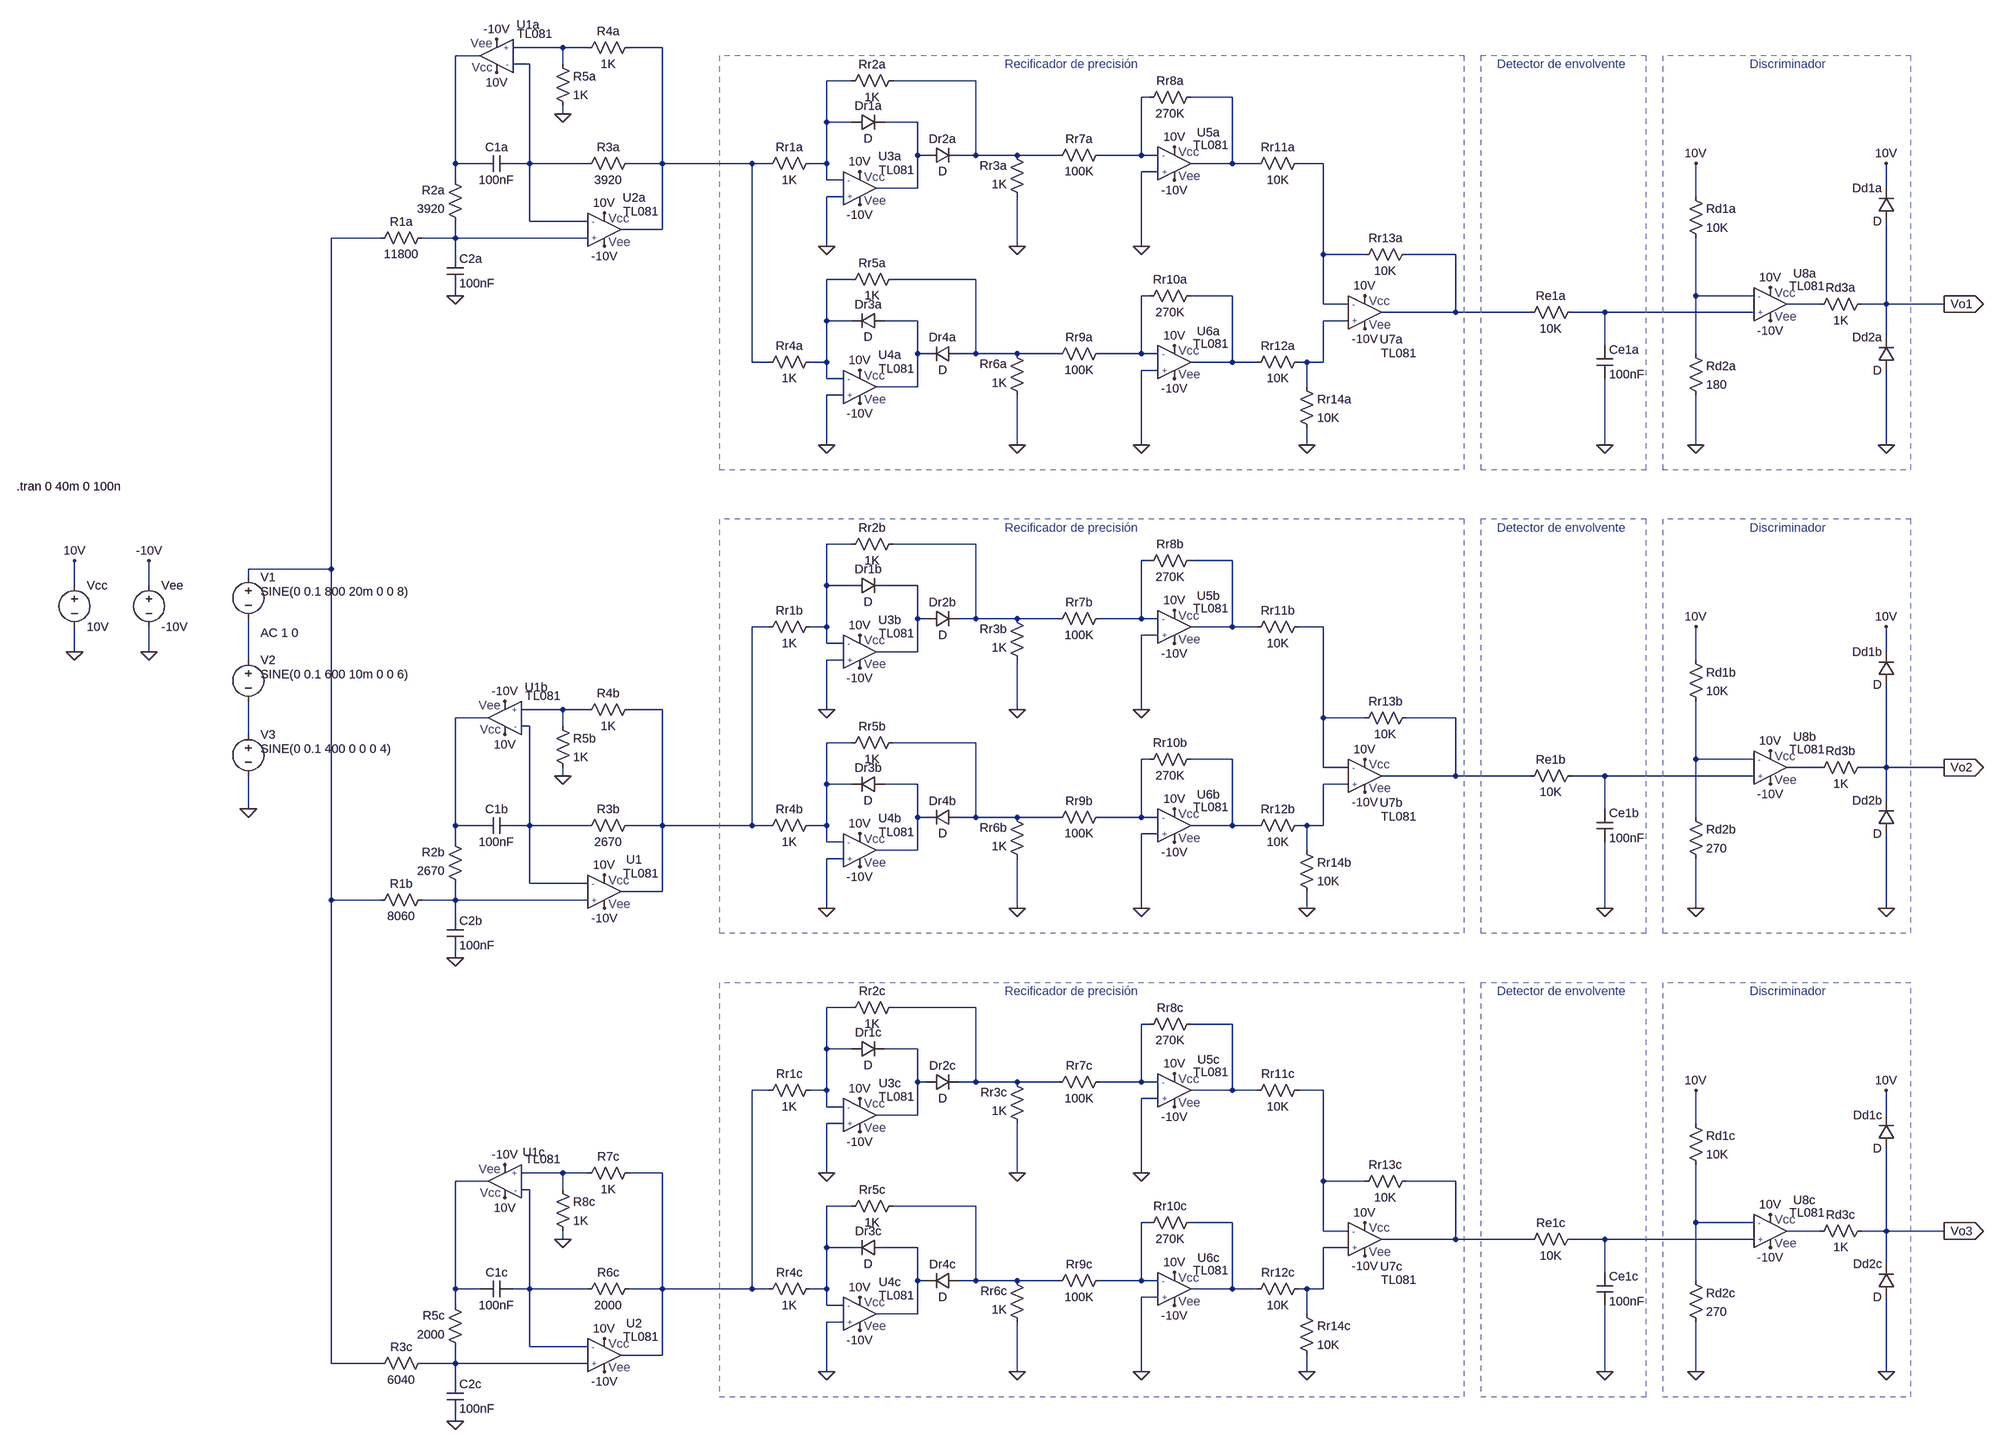
[diagram p0: schematic tl1.asc]
tl1.asc, the LTspice schematic file:
Version 4
SHEET 1 1076 680
WIRE -6400 -2448 -6496 -2448
WIRE -6352 -2448 -6400 -2448
WIRE -6208 -2448 -6272 -2448
WIRE -6560 -2432 -6608 -2432
WIRE -6464 -2416 -6496 -2416
WIRE -6400 -2416 -6400 -2448
WIRE -5792 -2384 -5840 -2384
WIRE -5552 -2384 -5712 -2384
WIRE -5216 -2352 -5232 -2352
WIRE -5056 -2352 -5136 -2352
WIRE -6400 -2320 -6400 -2336
WIRE -5840 -2304 -5840 -2384
WIRE -5792 -2304 -5840 -2304
WIRE -5664 -2304 -5728 -2304
WIRE -5664 -2240 -5664 -2304
WIRE -5648 -2240 -5664 -2240
WIRE -5552 -2240 -5552 -2384
WIRE -5552 -2240 -5584 -2240
WIRE -5472 -2240 -5552 -2240
WIRE -5392 -2240 -5472 -2240
WIRE -5232 -2240 -5232 -2352
WIRE -5232 -2240 -5312 -2240
WIRE -5200 -2240 -5232 -2240
WIRE -6608 -2224 -6608 -2432
WIRE -6560 -2224 -6608 -2224
WIRE -6464 -2224 -6464 -2416
WIRE -6464 -2224 -6496 -2224
WIRE -6352 -2224 -6464 -2224
WIRE -6208 -2224 -6208 -2448
WIRE -6208 -2224 -6272 -2224
WIRE -5984 -2224 -6208 -2224
WIRE -5952 -2224 -5984 -2224
WIRE -5840 -2224 -5840 -2304
WIRE -5840 -2224 -5872 -2224
WIRE -5056 -2224 -5056 -2352
WIRE -5056 -2224 -5136 -2224
WIRE -5008 -2224 -5056 -2224
WIRE -4880 -2224 -4928 -2224
WIRE -5200 -2208 -5232 -2208
WIRE -6608 -2192 -6608 -2224
WIRE -5840 -2192 -5840 -2224
WIRE -5808 -2192 -5840 -2192
WIRE -5664 -2176 -5664 -2240
WIRE -5664 -2176 -5744 -2176
WIRE -3792 -2176 -3792 -2224
WIRE -5808 -2160 -5840 -2160
WIRE -4160 -2160 -4160 -2224
WIRE -6464 -2112 -6464 -2224
WIRE -6352 -2112 -6464 -2112
WIRE -6208 -2096 -6208 -2224
WIRE -6208 -2096 -6288 -2096
WIRE -6752 -2080 -6848 -2080
WIRE -6608 -2080 -6608 -2112
WIRE -6608 -2080 -6672 -2080
WIRE -6352 -2080 -6608 -2080
WIRE -5840 -2064 -5840 -2160
WIRE -5472 -2064 -5472 -2160
WIRE -5232 -2064 -5232 -2208
WIRE -6608 -2048 -6608 -2080
WIRE -4880 -2048 -4880 -2224
WIRE -4800 -2048 -4880 -2048
WIRE -4624 -2048 -4720 -2048
WIRE -5792 -2000 -5840 -2000
WIRE -5552 -2000 -5712 -2000
WIRE -6608 -1968 -6608 -1984
WIRE -5216 -1968 -5232 -1968
WIRE -5056 -1968 -5136 -1968
WIRE -4160 -1968 -4160 -2080
WIRE -4048 -1968 -4160 -1968
WIRE -4880 -1952 -4880 -2048
WIRE -4832 -1952 -4880 -1952
WIRE -3920 -1952 -3984 -1952
WIRE -3792 -1952 -3792 -2112
WIRE -3792 -1952 -3840 -1952
WIRE -3680 -1952 -3792 -1952
WIRE -4624 -1936 -4624 -2048
WIRE -4624 -1936 -4768 -1936
WIRE -4480 -1936 -4624 -1936
WIRE -4336 -1936 -4400 -1936
WIRE -4048 -1936 -4336 -1936
WIRE -5840 -1920 -5840 -2000
WIRE -5792 -1920 -5840 -1920
WIRE -5664 -1920 -5728 -1920
WIRE -4832 -1920 -4880 -1920
WIRE -3792 -1888 -3792 -1952
WIRE -4336 -1872 -4336 -1936
WIRE -5664 -1856 -5664 -1920
WIRE -5648 -1856 -5664 -1856
WIRE -5552 -1856 -5552 -2000
WIRE -5552 -1856 -5584 -1856
WIRE -5472 -1856 -5552 -1856
WIRE -5392 -1856 -5472 -1856
WIRE -5232 -1856 -5232 -1968
WIRE -5232 -1856 -5312 -1856
WIRE -5200 -1856 -5232 -1856
WIRE -4160 -1856 -4160 -1968
WIRE -5984 -1840 -5984 -2224
WIRE -5952 -1840 -5984 -1840
WIRE -5840 -1840 -5840 -1920
WIRE -5840 -1840 -5872 -1840
WIRE -5056 -1840 -5056 -1968
WIRE -5056 -1840 -5136 -1840
WIRE -5008 -1840 -5056 -1840
WIRE -4912 -1840 -4928 -1840
WIRE -4880 -1840 -4880 -1920
WIRE -4880 -1840 -4912 -1840
WIRE -5200 -1824 -5232 -1824
WIRE -5840 -1808 -5840 -1840
WIRE -5808 -1808 -5840 -1808
WIRE -5664 -1792 -5664 -1856
WIRE -5664 -1792 -5744 -1792
WIRE -4912 -1792 -4912 -1840
WIRE -5808 -1776 -5840 -1776
WIRE -5840 -1680 -5840 -1776
WIRE -5472 -1680 -5472 -1776
WIRE -5232 -1680 -5232 -1824
WIRE -4912 -1680 -4912 -1712
WIRE -4336 -1680 -4336 -1808
WIRE -4160 -1680 -4160 -1776
WIRE -3792 -1680 -3792 -1824
WIRE -5792 -1488 -5840 -1488
WIRE -5552 -1488 -5712 -1488
WIRE -5216 -1456 -5232 -1456
WIRE -5056 -1456 -5136 -1456
WIRE -6848 -1440 -6848 -2080
WIRE -6848 -1440 -7008 -1440
WIRE -7008 -1424 -7008 -1440
WIRE -7344 -1408 -7344 -1456
WIRE -7200 -1408 -7200 -1456
WIRE -5840 -1408 -5840 -1488
WIRE -5792 -1408 -5840 -1408
WIRE -5664 -1408 -5728 -1408
WIRE -5664 -1344 -5664 -1408
WIRE -5648 -1344 -5664 -1344
WIRE -5552 -1344 -5552 -1488
WIRE -5552 -1344 -5584 -1344
WIRE -5472 -1344 -5552 -1344
WIRE -5392 -1344 -5472 -1344
WIRE -5232 -1344 -5232 -1456
WIRE -5232 -1344 -5312 -1344
WIRE -5200 -1344 -5232 -1344
WIRE -5952 -1328 -5984 -1328
WIRE -5840 -1328 -5840 -1408
WIRE -5840 -1328 -5872 -1328
WIRE -5056 -1328 -5056 -1456
WIRE -5056 -1328 -5136 -1328
WIRE -5008 -1328 -5056 -1328
WIRE -4880 -1328 -4928 -1328
WIRE -5200 -1312 -5232 -1312
WIRE -5840 -1296 -5840 -1328
WIRE -5808 -1296 -5840 -1296
WIRE -7344 -1280 -7344 -1328
WIRE -7200 -1280 -7200 -1328
WIRE -5664 -1280 -5664 -1344
WIRE -5664 -1280 -5744 -1280
WIRE -3792 -1280 -3792 -1328
WIRE -7008 -1264 -7008 -1344
WIRE -5808 -1264 -5840 -1264
WIRE -4160 -1264 -4160 -1328
WIRE -6400 -1168 -6480 -1168
WIRE -6352 -1168 -6400 -1168
WIRE -6208 -1168 -6272 -1168
WIRE -5840 -1168 -5840 -1264
WIRE -5472 -1168 -5472 -1264
WIRE -5232 -1168 -5232 -1312
WIRE -6544 -1152 -6608 -1152
WIRE -4880 -1152 -4880 -1328
WIRE -4800 -1152 -4880 -1152
WIRE -4624 -1152 -4720 -1152
WIRE -6464 -1136 -6480 -1136
WIRE -6400 -1136 -6400 -1168
WIRE -7008 -1120 -7008 -1184
WIRE -5792 -1104 -5840 -1104
WIRE -5552 -1104 -5712 -1104
WIRE -5216 -1072 -5232 -1072
WIRE -5056 -1072 -5136 -1072
WIRE -4160 -1072 -4160 -1184
WIRE -4048 -1072 -4160 -1072
WIRE -4880 -1056 -4880 -1152
WIRE -4832 -1056 -4880 -1056
WIRE -3920 -1056 -3984 -1056
WIRE -3792 -1056 -3792 -1216
WIRE -3792 -1056 -3840 -1056
WIRE -3680 -1056 -3792 -1056
WIRE -6400 -1040 -6400 -1056
WIRE -4624 -1040 -4624 -1152
WIRE -4624 -1040 -4768 -1040
WIRE -4480 -1040 -4624 -1040
WIRE -4336 -1040 -4400 -1040
WIRE -4048 -1040 -4336 -1040
WIRE -5840 -1024 -5840 -1104
WIRE -5792 -1024 -5840 -1024
WIRE -5664 -1024 -5728 -1024
WIRE -4832 -1024 -4880 -1024
WIRE -3792 -992 -3792 -1056
WIRE -7008 -976 -7008 -1040
WIRE -4336 -976 -4336 -1040
WIRE -5664 -960 -5664 -1024
WIRE -5648 -960 -5664 -960
WIRE -5552 -960 -5552 -1104
WIRE -5552 -960 -5584 -960
WIRE -5472 -960 -5552 -960
WIRE -5392 -960 -5472 -960
WIRE -5232 -960 -5232 -1072
WIRE -5232 -960 -5312 -960
WIRE -5200 -960 -5232 -960
WIRE -4160 -960 -4160 -1072
WIRE -6608 -944 -6608 -1152
WIRE -6560 -944 -6608 -944
WIRE -6464 -944 -6464 -1136
WIRE -6464 -944 -6496 -944
WIRE -6352 -944 -6464 -944
WIRE -6208 -944 -6208 -1168
WIRE -6208 -944 -6272 -944
WIRE -5984 -944 -5984 -1328
WIRE -5984 -944 -6208 -944
WIRE -5952 -944 -5984 -944
WIRE -5840 -944 -5840 -1024
WIRE -5840 -944 -5872 -944
WIRE -5056 -944 -5056 -1072
WIRE -5056 -944 -5136 -944
WIRE -5008 -944 -5056 -944
WIRE -4912 -944 -4928 -944
WIRE -4880 -944 -4880 -1024
WIRE -4880 -944 -4912 -944
WIRE -5200 -928 -5232 -928
WIRE -6608 -912 -6608 -944
WIRE -5840 -912 -5840 -944
WIRE -5808 -912 -5840 -912
WIRE -5664 -896 -5664 -960
WIRE -5664 -896 -5744 -896
WIRE -4912 -896 -4912 -944
WIRE -5808 -880 -5840 -880
WIRE -6464 -832 -6464 -944
WIRE -6352 -832 -6464 -832
WIRE -6208 -816 -6208 -944
WIRE -6208 -816 -6288 -816
WIRE -6848 -800 -6848 -1440
WIRE -6752 -800 -6848 -800
WIRE -6608 -800 -6608 -832
WIRE -6608 -800 -6672 -800
WIRE -6352 -800 -6608 -800
WIRE -5840 -784 -5840 -880
WIRE -5472 -784 -5472 -880
WIRE -5232 -784 -5232 -928
WIRE -4912 -784 -4912 -816
WIRE -4336 -784 -4336 -912
WIRE -4160 -784 -4160 -880
WIRE -3792 -784 -3792 -928
WIRE -6608 -768 -6608 -800
WIRE -6608 -688 -6608 -704
WIRE -5792 -592 -5840 -592
WIRE -5552 -592 -5712 -592
WIRE -5216 -560 -5232 -560
WIRE -5056 -560 -5136 -560
WIRE -5840 -512 -5840 -592
WIRE -5792 -512 -5840 -512
WIRE -5664 -512 -5728 -512
WIRE -5664 -448 -5664 -512
WIRE -5648 -448 -5664 -448
WIRE -5552 -448 -5552 -592
WIRE -5552 -448 -5584 -448
WIRE -5472 -448 -5552 -448
WIRE -5392 -448 -5472 -448
WIRE -5232 -448 -5232 -560
WIRE -5232 -448 -5312 -448
WIRE -5200 -448 -5232 -448
WIRE -5952 -432 -5984 -432
WIRE -5840 -432 -5840 -512
WIRE -5840 -432 -5872 -432
WIRE -5056 -432 -5056 -560
WIRE -5056 -432 -5136 -432
WIRE -5008 -432 -5056 -432
WIRE -4880 -432 -4928 -432
WIRE -5200 -416 -5232 -416
WIRE -5840 -400 -5840 -432
WIRE -5808 -400 -5840 -400
WIRE -5664 -384 -5664 -448
WIRE -5664 -384 -5744 -384
WIRE -3792 -384 -3792 -432
WIRE -5808 -368 -5840 -368
WIRE -4160 -368 -4160 -432
WIRE -6400 -272 -6480 -272
WIRE -6352 -272 -6400 -272
WIRE -6208 -272 -6272 -272
WIRE -5840 -272 -5840 -368
WIRE -5472 -272 -5472 -368
WIRE -5232 -272 -5232 -416
WIRE -6544 -256 -6608 -256
WIRE -4880 -256 -4880 -432
WIRE -4800 -256 -4880 -256
WIRE -4624 -256 -4720 -256
WIRE -6464 -240 -6480 -240
WIRE -6400 -240 -6400 -272
WIRE -5792 -208 -5840 -208
WIRE -5552 -208 -5712 -208
WIRE -5216 -176 -5232 -176
WIRE -5056 -176 -5136 -176
WIRE -4160 -176 -4160 -288
WIRE -4048 -176 -4160 -176
WIRE -4880 -160 -4880 -256
WIRE -4832 -160 -4880 -160
WIRE -3920 -160 -3984 -160
WIRE -3792 -160 -3792 -320
WIRE -3792 -160 -3840 -160
WIRE -3680 -160 -3792 -160
WIRE -6400 -144 -6400 -160
WIRE -4624 -144 -4624 -256
WIRE -4624 -144 -4768 -144
WIRE -4480 -144 -4624 -144
WIRE -4336 -144 -4400 -144
WIRE -4048 -144 -4336 -144
WIRE -5840 -128 -5840 -208
WIRE -5792 -128 -5840 -128
WIRE -5664 -128 -5728 -128
WIRE -4832 -128 -4880 -128
WIRE -3792 -96 -3792 -160
WIRE -4336 -80 -4336 -144
WIRE -5664 -64 -5664 -128
WIRE -5648 -64 -5664 -64
WIRE -5552 -64 -5552 -208
WIRE -5552 -64 -5584 -64
WIRE -5472 -64 -5552 -64
WIRE -5392 -64 -5472 -64
WIRE -5232 -64 -5232 -176
WIRE -5232 -64 -5312 -64
WIRE -5200 -64 -5232 -64
WIRE -4160 -64 -4160 -176
WIRE -6608 -48 -6608 -256
WIRE -6560 -48 -6608 -48
WIRE -6464 -48 -6464 -240
WIRE -6464 -48 -6496 -48
WIRE -6352 -48 -6464 -48
WIRE -6208 -48 -6208 -272
WIRE -6208 -48 -6272 -48
WIRE -5984 -48 -5984 -432
WIRE -5984 -48 -6208 -48
WIRE -5952 -48 -5984 -48
WIRE -5840 -48 -5840 -128
WIRE -5840 -48 -5872 -48
WIRE -5056 -48 -5056 -176
WIRE -5056 -48 -5136 -48
WIRE -5008 -48 -5056 -48
WIRE -4912 -48 -4928 -48
WIRE -4880 -48 -4880 -128
WIRE -4880 -48 -4912 -48
WIRE -5200 -32 -5232 -32
WIRE -6608 -16 -6608 -48
WIRE -5840 -16 -5840 -48
WIRE -5808 -16 -5840 -16
WIRE -5664 0 -5664 -64
WIRE -5664 0 -5744 0
WIRE -4912 0 -4912 -48
WIRE -5808 16 -5840 16
WIRE -6464 64 -6464 -48
WIRE -6352 64 -6464 64
WIRE -6208 80 -6208 -48
WIRE -6208 80 -6288 80
WIRE -6848 96 -6848 -800
WIRE -6752 96 -6848 96
WIRE -6608 96 -6608 64
WIRE -6608 96 -6672 96
WIRE -6352 96 -6608 96
WIRE -5840 112 -5840 16
WIRE -5472 112 -5472 16
WIRE -5232 112 -5232 -32
WIRE -4912 112 -4912 80
WIRE -4336 112 -4336 -16
WIRE -4160 112 -4160 16
WIRE -3792 112 -3792 -32
WIRE -6608 128 -6608 96
WIRE -6608 208 -6608 192
FLAG -6400 -2320 0
FLAG -6608 -1968 0
FLAG -6400 -1040 0
FLAG -6608 -688 0
FLAG -6400 -144 0
FLAG -6608 208 0
FLAG -7008 -976 0
FLAG -5840 -2064 0
FLAG -5472 -2064 0
FLAG -7344 -1456 10V
FLAG -7344 -1280 0
FLAG -5840 -1680 0
FLAG -5472 -1680 0
FLAG -5232 -2064 0
FLAG -4912 -1680 0
FLAG -4336 -1680 0
FLAG -4160 -1680 0
FLAG -4160 -2224 10V
FLAG -3792 -1680 0
FLAG -3792 -2224 10V
FLAG -3680 -1952 Vo1
IOPIN -3680 -1952 Out
FLAG -6512 -1120 10V
FLAG -6512 -1184 -10V
FLAG -7200 -1456 -10V
FLAG -7200 -1280 0
FLAG -6320 -2128 10V
FLAG -6320 -2064 -10V
FLAG -6512 -224 10V
FLAG -6512 -288 -10V
FLAG -6528 -2400 10V
FLAG -6528 -2464 -10V
FLAG -6320 -848 10V
FLAG -6320 -784 -10V
FLAG -6320 48 10V
FLAG -6320 112 -10V
FLAG -5168 -2256 10V
FLAG -5168 -2192 -10V
FLAG -4800 -1968 10V
FLAG -4800 -1904 -10V
FLAG -5232 -1680 0
FLAG -5168 -1872 10V
FLAG -5168 -1808 -10V
FLAG -5776 -2208 10V
FLAG -5776 -2144 -10V
FLAG -5776 -1824 10V
FLAG -5776 -1760 -10V
FLAG -4016 -1984 10V
FLAG -4016 -1920 -10V
FLAG -5840 -1168 0
FLAG -5472 -1168 0
FLAG -5840 -784 0
FLAG -5472 -784 0
FLAG -5232 -1168 0
FLAG -4912 -784 0
FLAG -4336 -784 0
FLAG -4160 -784 0
FLAG -4160 -1328 10V
FLAG -3792 -784 0
FLAG -3792 -1328 10V
FLAG -3680 -1056 Vo2
IOPIN -3680 -1056 Out
FLAG -5168 -1360 10V
FLAG -5168 -1296 -10V
FLAG -4800 -1072 10V
FLAG -4800 -1008 -10V
FLAG -5232 -784 0
FLAG -5168 -976 10V
FLAG -5168 -912 -10V
FLAG -5776 -1312 10V
FLAG -5776 -1248 -10V
FLAG -5776 -928 10V
FLAG -5776 -864 -10V
FLAG -4016 -1088 10V
FLAG -4016 -1024 -10V
FLAG -5840 -272 0
FLAG -5472 -272 0
FLAG -5840 112 0
FLAG -5472 112 0
FLAG -5232 -272 0
FLAG -4912 112 0
FLAG -4336 112 0
FLAG -4160 112 0
FLAG -4160 -432 10V
FLAG -3792 112 0
FLAG -3792 -432 10V
FLAG -3680 -160 Vo3
IOPIN -3680 -160 Out
FLAG -5168 -464 10V
FLAG -5168 -400 -10V
FLAG -4800 -176 10V
FLAG -4800 -112 -10V
FLAG -5232 112 0
FLAG -5168 -80 10V
FLAG -5168 -16 -10V
FLAG -5776 -416 10V
FLAG -5776 -352 -10V
FLAG -5776 -32 10V
FLAG -5776 32 -10V
FLAG -4016 -192 10V
FLAG -4016 -128 -10V
SYMBOL res -6656 -2096 R90
WINDOW 0 0 56 VBottom 2
WINDOW 3 32 56 VTop 2
SYMATTR InstName R1a
SYMATTR Value 11800
SYMBOL res -6592 -2096 R180
WINDOW 0 36 76 Left 2
WINDOW 3 36 40 Left 2
SYMATTR InstName R2a
SYMATTR Value 3920
SYMBOL res -6368 -2208 R270
WINDOW 0 32 56 VTop 2
WINDOW 3 0 56 VBottom 2
SYMATTR InstName R3a
SYMATTR Value 3920
SYMBOL res -6368 -2432 R270
WINDOW 0 32 56 VTop 2
WINDOW 3 0 56 VBottom 2
SYMATTR InstName R4a
SYMATTR Value 1K
SYMBOL res -6416 -2432 R0
SYMATTR InstName R5a
SYMATTR Value 1K
SYMBOL cap -6496 -2240 R90
WINDOW 0 0 32 VBottom 2
WINDOW 3 32 32 VTop 2
SYMATTR InstName C1a
SYMATTR Value 100nF
SYMBOL cap -6624 -2048 R0
SYMATTR InstName C2a
SYMATTR Value 100nF
SYMBOL voltage -7008 -1440 R0
WINDOW 3 24 44 Left 2
WINDOW 123 24 124 Left 2
WINDOW 39 0 0 Left 2
SYMATTR Value SINE(0 0.1 800 20m 0 0 8)
SYMATTR Value2 AC 1 0
SYMATTR InstName V1
SYMBOL res -6656 -816 R90
WINDOW 0 0 56 VBottom 2
WINDOW 3 32 56 VTop 2
SYMATTR InstName R1b
SYMATTR Value 8060
SYMBOL res -6592 -816 R180
WINDOW 0 36 76 Left 2
WINDOW 3 36 40 Left 2
SYMATTR InstName R2b
SYMATTR Value 2670
SYMBOL res -6368 -928 R270
WINDOW 0 32 56 VTop 2
WINDOW 3 0 56 VBottom 2
SYMATTR InstName R3b
SYMATTR Value 2670
SYMBOL res -6368 -1152 R270
WINDOW 0 32 56 VTop 2
WINDOW 3 0 56 VBottom 2
SYMATTR InstName R4b
SYMATTR Value 1K
SYMBOL res -6416 -1152 R0
SYMATTR InstName R5b
SYMATTR Value 1K
SYMBOL cap -6496 -960 R90
WINDOW 0 0 32 VBottom 2
WINDOW 3 32 32 VTop 2
SYMATTR InstName C1b
SYMATTR Value 100nF
SYMBOL cap -6624 -768 R0
SYMATTR InstName C2b
SYMATTR Value 100nF
SYMBOL res -6656 80 R90
WINDOW 0 0 56 VBottom 2
WINDOW 3 32 56 VTop 2
SYMATTR InstName R3c
SYMATTR Value 6040
SYMBOL res -6592 80 R180
WINDOW 0 36 76 Left 2
WINDOW 3 36 40 Left 2
SYMATTR InstName R5c
SYMATTR Value 2000
SYMBOL res -6368 -32 R270
WINDOW 0 32 56 VTop 2
WINDOW 3 0 56 VBottom 2
SYMATTR InstName R6c
SYMATTR Value 2000
SYMBOL res -6368 -256 R270
WINDOW 0 32 56 VTop 2
WINDOW 3 0 56 VBottom 2
SYMATTR InstName R7c
SYMATTR Value 1K
SYMBOL res -6416 -256 R0
SYMATTR InstName R8c
SYMATTR Value 1K
SYMBOL cap -6496 -64 R90
WINDOW 0 0 32 VBottom 2
WINDOW 3 32 32 VTop 2
SYMATTR InstName C1c
SYMATTR Value 100nF
SYMBOL cap -6624 128 R0
SYMATTR InstName C2c
SYMATTR Value 100nF
SYMBOL voltage -7008 -1280 R0
WINDOW 3 24 44 Left 2
WINDOW 123 24 124 Left 2
WINDOW 39 0 0 Left 2
SYMATTR Value SINE(0 0.1 600 10m 0 0 6)
SYMATTR InstName V2
SYMBOL voltage -7008 -1136 R0
WINDOW 3 24 44 Left 2
WINDOW 123 24 124 Left 2
WINDOW 39 0 0 Left 2
SYMATTR Value SINE(0 0.1 400 0 0 0 4)
SYMATTR InstName V3
SYMBOL res -5856 -2240 R90
WINDOW 0 0 56 VBottom 2
WINDOW 3 32 56 VTop 2
SYMATTR InstName Rr1a
SYMATTR Value 1K
SYMBOL res -5696 -2400 R90
WINDOW 0 0 56 VBottom 2
WINDOW 3 32 56 VTop 2
SYMATTR InstName Rr2a
SYMATTR Value 1K
SYMBOL res -5456 -2144 R180
WINDOW 0 36 76 Left 2
WINDOW 3 36 40 Left 2
SYMATTR InstName Rr3a
SYMATTR Value 1K
SYMBOL diode -5792 -2288 R270
WINDOW 0 32 32 VTop 2
WINDOW 3 0 32 VBottom 2
SYMATTR InstName Dr1a
SYMBOL diode -5648 -2224 R270
WINDOW 0 32 32 VTop 2
WINDOW 3 0 32 VBottom 2
SYMATTR InstName Dr2a
SYMBOL res -5296 -2256 R90
WINDOW 0 0 56 VBottom 2
WINDOW 3 32 56 VTop 2
SYMATTR InstName Rr7a
SYMATTR Value 100K
SYMBOL voltage -7344 -1424 R0
WINDOW 123 0 0 Left 2
WINDOW 39 0 0 Left 2
SYMATTR InstName Vcc
SYMATTR Value 10V
SYMBOL res -5856 -1856 R90
WINDOW 0 0 56 VBottom 2
WINDOW 3 32 56 VTop 2
SYMATTR InstName Rr4a
SYMATTR Value 1K
SYMBOL res -5696 -2016 R90
WINDOW 0 0 56 VBottom 2
WINDOW 3 32 56 VTop 2
SYMATTR InstName Rr5a
SYMATTR Value 1K
SYMBOL res -5456 -1760 R180
WINDOW 0 36 76 Left 2
WINDOW 3 36 40 Left 2
SYMATTR InstName Rr6a
SYMATTR Value 1K
SYMBOL res -5296 -1872 R90
WINDOW 0 0 56 VBottom 2
WINDOW 3 32 56 VTop 2
SYMATTR InstName Rr9a
SYMATTR Value 100K
SYMBOL diode -5728 -1936 R90
WINDOW 0 0 32 VBottom 2
WINDOW 3 32 32 VTop 2
SYMATTR InstName Dr3a
SYMBOL diode -5584 -1872 R90
WINDOW 0 0 32 VBottom 2
WINDOW 3 32 32 VTop 2
SYMATTR InstName Dr4a
SYMBOL res -5120 -2368 R90
WINDOW 0 0 56 VBottom 2
WINDOW 3 32 56 VTop 2
SYMATTR InstName Rr8a
SYMATTR Value 270K
SYMBOL res -4912 -1856 R90
WINDOW 0 0 56 VBottom 2
WINDOW 3 32 56 VTop 2
SYMATTR InstName Rr12a
SYMATTR Value 10K
SYMBOL res -4704 -2064 R90
WINDOW 0 0 56 VBottom 2
WINDOW 3 32 56 VTop 2
SYMATTR InstName Rr13a
SYMATTR Value 10K
SYMBOL res -4912 -2240 R90
WINDOW 0 0 56 VBottom 2
WINDOW 3 32 56 VTop 2
SYMATTR InstName Rr11a
SYMATTR Value 10K
SYMBOL res -4928 -1808 R0
SYMATTR InstName Rr14a
SYMATTR Value 10K
SYMBOL res -4384 -1952 R90
WINDOW 0 0 56 VBottom 2
WINDOW 3 32 56 VTop 2
SYMATTR InstName Re1a
SYMATTR Value 10K
SYMBOL cap -4352 -1872 R0
SYMATTR InstName Ce1a
SYMATTR Value 100nF
SYMBOL res -4176 -2176 R0
SYMATTR InstName Rd1a
SYMATTR Value 10K
SYMBOL res -4176 -1872 R0
SYMATTR InstName Rd2a
SYMATTR Value 180
SYMBOL res -3824 -1968 R90
WINDOW 0 0 56 VBottom 2
WINDOW 3 32 56 VTop 2
SYMATTR InstName Rd3a
SYMATTR Value 1K
SYMBOL diode -3776 -2112 R180
WINDOW 0 24 64 Left 2
WINDOW 3 24 0 Left 2
SYMATTR InstName Dd1a
SYMBOL diode -3776 -1824 R180
WINDOW 0 24 64 Left 2
WINDOW 3 24 0 Left 2
SYMATTR InstName Dd2a
SYMBOL AutoGenerated\\TL081 -6512 -1152 R180
WINDOW 0 -61 75 Bottom 2
WINDOW 3 -74 27 Top 2
SYMATTR InstName U1b
SYMBOL voltage -7200 -1424 R0
WINDOW 123 0 0 Left 2
WINDOW 39 0 0 Left 2
SYMATTR InstName Vee
SYMATTR Value -10V
SYMBOL AutoGenerated\\TL081 -6320 -2096 R0
WINDOW 0 58 -46 Bottom 2
SYMATTR InstName U2a
SYMBOL AutoGenerated\\TL081 -6512 -256 R180
WINDOW 0 -56 72 Bottom 2
WINDOW 3 -74 27 Top 2
SYMATTR InstName U1c
SYMBOL AutoGenerated\\TL081 -6528 -2432 R180
WINDOW 0 -61 76 Bottom 2
WINDOW 3 -74 27 Top 2
SYMATTR InstName U1a
SYMBOL AutoGenerated\\TL081 -6320 -816 R0
WINDOW 0 58 -46 Bottom 2
SYMATTR InstName U1
SYMBOL AutoGenerated\\TL081 -6320 80 R0
WINDOW 0 58 -46 Bottom 2
SYMATTR InstName U2
SYMBOL AutoGenerated\\TL081 -5168 -2224 R0
SYMATTR InstName U5a
SYMBOL AutoGenerated\\TL081 -4800 -1936 R0
WINDOW 0 51 68 Bottom 2
WINDOW 3 66 63 Top 2
SYMATTR InstName U7a
SYMBOL res -5120 -1984 R90
WINDOW 0 0 56 VBottom 2
WINDOW 3 32 56 VTop 2
SYMATTR InstName Rr10a
SYMATTR Value 270K
SYMBOL AutoGenerated\\TL081 -5168 -1840 R0
SYMATTR InstName U6a
SYMBOL AutoGenerated\\TL081 -5776 -2176 R0
WINDOW 0 58 -46 Bottom 2
SYMATTR InstName U3a
SYMBOL AutoGenerated\\TL081 -5776 -1792 R0
WINDOW 0 58 -46 Bottom 2
SYMATTR InstName U4a
SYMBOL AutoGenerated\\TL081 -4016 -1952 R0
SYMATTR InstName U8a
SYMBOL res -5856 -1344 R90
WINDOW 0 0 56 VBottom 2
WINDOW 3 32 56 VTop 2
SYMATTR InstName Rr1b
SYMATTR Value 1K
SYMBOL res -5696 -1504 R90
WINDOW 0 0 56 VBottom 2
WINDOW 3 32 56 VTop 2
SYMATTR InstName Rr2b
SYMATTR Value 1K
SYMBOL res -5456 -1248 R180
WINDOW 0 36 76 Left 2
WINDOW 3 36 40 Left 2
SYMATTR InstName Rr3b
SYMATTR Value 1K
SYMBOL diode -5792 -1392 R270
WINDOW 0 32 32 VTop 2
WINDOW 3 0 32 VBottom 2
SYMATTR InstName Dr1b
SYMBOL diode -5648 -1328 R270
WINDOW 0 32 32 VTop 2
WINDOW 3 0 32 VBottom 2
SYMATTR InstName Dr2b
SYMBOL res -5296 -1360 R90
WINDOW 0 0 56 VBottom 2
WINDOW 3 32 56 VTop 2
SYMATTR InstName Rr7b
SYMATTR Value 100K
SYMBOL res -5856 -960 R90
WINDOW 0 0 56 VBottom 2
WINDOW 3 32 56 VTop 2
SYMATTR InstName Rr4b
SYMATTR Value 1K
SYMBOL res -5696 -1120 R90
WINDOW 0 0 56 VBottom 2
WINDOW 3 32 56 VTop 2
SYMATTR InstName Rr5b
SYMATTR Value 1K
SYMBOL res -5456 -864 R180
WINDOW 0 36 76 Left 2
WINDOW 3 36 40 Left 2
SYMATTR InstName Rr6b
SYMATTR Value 1K
SYMBOL res -5296 -976 R90
WINDOW 0 0 56 VBottom 2
WINDOW 3 32 56 VTop 2
SYMATTR InstName Rr9b
SYMATTR Value 100K
SYMBOL diode -5728 -1040 R90
WINDOW 0 0 32 VBottom 2
WINDOW 3 32 32 VTop 2
SYMATTR InstName Dr3b
SYMBOL diode -5584 -976 R90
WINDOW 0 0 32 VBottom 2
WINDOW 3 32 32 VTop 2
SYMATTR InstName Dr4b
SYMBOL res -5120 -1472 R90
WINDOW 0 0 56 VBottom 2
WINDOW 3 32 56 VTop 2
SYMATTR InstName Rr8b
SYMATTR Value 270K
SYMBOL res -4912 -960 R90
WINDOW 0 0 56 VBottom 2
WINDOW 3 32 56 VTop 2
SYMATTR InstName Rr12b
SYMATTR Value 10K
SYMBOL res -4704 -1168 R90
WINDOW 0 0 56 VBottom 2
WINDOW 3 32 56 VTop 2
SYMATTR InstName Rr13b
SYMATTR Value 10K
SYMBOL res -4912 -1344 R90
WINDOW 0 0 56 VBottom 2
WINDOW 3 32 56 VTop 2
SYMATTR InstName Rr11b
SYMATTR Value 10K
SYMBOL res -4928 -912 R0
SYMATTR InstName Rr14b
SYMATTR Value 10K
SYMBOL res -4384 -1056 R90
WINDOW 0 0 56 VBottom 2
WINDOW 3 32 56 VTop 2
SYMATTR InstName Re1b
SYMATTR Value 10K
SYMBOL cap -4352 -976 R0
SYMATTR InstName Ce1b
SYMATTR Value 100nF
SYMBOL res -4176 -1280 R0
SYMATTR InstName Rd1b
SYMATTR Value 10K
SYMBOL res -4176 -976 R0
SYMATTR InstName Rd2b
SYMATTR Value 270
SYMBOL res -3824 -1072 R90
WINDOW 0 0 56 VBottom 2
WINDOW 3 32 56 VTop 2
SYMATTR InstName Rd3b
SYMATTR Value 1K
SYMBOL diode -3776 -1216 R180
WINDOW 0 24 64 Left 2
WINDOW 3 24 0 Left 2
SYMATTR InstName Dd1b
SYMBOL diode -3776 -928 R180
WINDOW 0 24 64 Left 2
WINDOW 3 24 0 Left 2
SYMATTR InstName Dd2b
SYMBOL AutoGenerated\\TL081 -5168 -1328 R0
SYMATTR InstName U5b
SYMBOL AutoGenerated\\TL081 -4800 -1040 R0
WINDOW 0 51 68 Bottom 2
WINDOW 3 66 63 Top 2
SYMATTR InstName U7b
SYMBOL res -5120 -1088 R90
WINDOW 0 0 56 VBottom 2
WINDOW 3 32 56 VTop 2
SYMATTR InstName Rr10b
SYMATTR Value 270K
SYMBOL AutoGenerated\\TL081 -5168 -944 R0
SYMATTR InstName U6b
SYMBOL AutoGenerated\\TL081 -5776 -1280 R0
WINDOW 0 58 -46 Bottom 2
SYMATTR InstName U3b
SYMBOL AutoGenerated\\TL081 -5776 -896 R0
WINDOW 0 58 -46 Bottom 2
SYMATTR InstName U4b
SYMBOL AutoGenerated\\TL081 -4016 -1056 R0
SYMATTR InstName U8b
SYMBOL res -5856 -448 R90
WINDOW 0 0 56 VBottom 2
WINDOW 3 32 56 VTop 2
SYMATTR InstName Rr1c
SYMATTR Value 1K
SYMBOL res -5696 -608 R90
WINDOW 0 0 56 VBottom 2
WINDOW 3 32 56 VTop 2
SYMATTR InstName Rr2c
SYMATTR Value 1K
SYMBOL res -5456 -352 R180
WINDOW 0 36 76 Left 2
WINDOW 3 36 40 Left 2
SYMATTR InstName Rr3c
SYMATTR Value 1K
SYMBOL diode -5792 -496 R270
WINDOW 0 32 32 VTop 2
WINDOW 3 0 32 VBottom 2
SYMATTR InstName Dr1c
SYMBOL diode -5648 -432 R270
WINDOW 0 32 32 VTop 2
WINDOW 3 0 32 VBottom 2
SYMATTR InstName Dr2c
SYMBOL res -5296 -464 R90
WINDOW 0 0 56 VBottom 2
WINDOW 3 32 56 VTop 2
SYMATTR InstName Rr7c
SYMATTR Value 100K
SYMBOL res -5856 -64 R90
WINDOW 0 0 56 VBottom 2
WINDOW 3 32 56 VTop 2
SYMATTR InstName Rr4c
SYMATTR Value 1K
SYMBOL res -5696 -224 R90
WINDOW 0 0 56 VBottom 2
WINDOW 3 32 56 VTop 2
SYMATTR InstName Rr5c
SYMATTR Value 1K
SYMBOL res -5456 32 R180
WINDOW 0 36 76 Left 2
WINDOW 3 36 40 Left 2
SYMATTR InstName Rr6c
SYMATTR Value 1K
SYMBOL res -5296 -80 R90
WINDOW 0 0 56 VBottom 2
WINDOW 3 32 56 VTop 2
SYMATTR InstName Rr9c
SYMATTR Value 100K
SYMBOL diode -5728 -144 R90
WINDOW 0 0 32 VBottom 2
WINDOW 3 32 32 VTop 2
SYMATTR InstName Dr3c
SYMBOL diode -5584 -80 R90
WINDOW 0 0 32 VBottom 2
WINDOW 3 32 32 VTop 2
SYMATTR InstName Dr4c
SYMBOL res -5120 -576 R90
WINDOW 0 0 56 VBottom 2
WINDOW 3 32 56 VTop 2
SYMATTR InstName Rr8c
SYMATTR Value 270K
SYMBOL res -4912 -64 R90
WINDOW 0 0 56 VBottom 2
WINDOW 3 32 56 VTop 2
SYMATTR InstName Rr12c
SYMATTR Value 10K
SYMBOL res -4704 -272 R90
WINDOW 0 0 56 VBottom 2
WINDOW 3 32 56 VTop 2
SYMATTR InstName Rr13c
SYMATTR Value 10K
SYMBOL res -4912 -448 R90
WINDOW 0 0 56 VBottom 2
WINDOW 3 32 56 VTop 2
SYMATTR InstName Rr11c
SYMATTR Value 10K
SYMBOL res -4928 -16 R0
SYMATTR InstName Rr14c
SYMATTR Value 10K
SYMBOL res -4384 -160 R90
WINDOW 0 0 56 VBottom 2
WINDOW 3 32 56 VTop 2
SYMATTR InstName Re1c
SYMATTR Value 10K
SYMBOL cap -4352 -80 R0
SYMATTR InstName Ce1c
SYMATTR Value 100nF
SYMBOL res -4176 -384 R0
SYMATTR InstName Rd1c
SYMATTR Value 10K
SYMBOL res -4176 -80 R0
SYMATTR InstName Rd2c
SYMATTR Value 270
SYMBOL res -3824 -176 R90
WINDOW 0 0 56 VBottom 2
WINDOW 3 32 56 VTop 2
SYMATTR InstName Rd3c
SYMATTR Value 1K
SYMBOL diode -3776 -320 R180
WINDOW 0 24 64 Left 2
WINDOW 3 24 0 Left 2
SYMATTR InstName Dd1c
SYMBOL diode -3776 -32 R180
WINDOW 0 24 64 Left 2
WINDOW 3 24 0 Left 2
SYMATTR InstName Dd2c
SYMBOL AutoGenerated\\TL081 -5168 -432 R0
SYMATTR InstName U5c
SYMBOL AutoGenerated\\TL081 -4800 -144 R0
WINDOW 0 51 68 Bottom 2
WINDOW 3 66 63 Top 2
SYMATTR InstName U7c
SYMBOL res -5120 -192 R90
WINDOW 0 0 56 VBottom 2
WINDOW 3 32 56 VTop 2
SYMATTR InstName Rr10c
SYMATTR Value 270K
SYMBOL AutoGenerated\\TL081 -5168 -48 R0
SYMATTR InstName U6c
SYMBOL AutoGenerated\\TL081 -5776 -384 R0
WINDOW 0 58 -46 Bottom 2
SYMATTR InstName U3c
SYMBOL AutoGenerated\\TL081 -5776 0 R0
WINDOW 0 58 -46 Bottom 2
SYMATTR InstName U4c
SYMBOL AutoGenerated\\TL081 -4016 -160 R0
SYMATTR InstName U8c
TEXT -7456 -1600 Left 2 !.tran 0 40m 0 100n
TEXT -5496 -2416 Left 2 ;Recificador de precisión
TEXT -4544 -2416 Left 2 ;Detector de envolvente
TEXT -4056 -2416 Left 2 ;Discriminador
TEXT -5496 -1520 Left 2 ;Recificador de precisión
TEXT -4544 -1520 Left 2 ;Detector de envolvente
TEXT -4056 -1520 Left 2 ;Discriminador
TEXT -5496 -624 Left 2 ;Recificador de precisión
TEXT -4544 -624 Left 2 ;Detector de envolvente
TEXT -4056 -624 Left 2 ;Discriminador
RECTANGLE Normal -4608 -2432 -6048 -1632 2
RECTANGLE Normal -4256 -2432 -4576 -1632 2
RECTANGLE Normal -3744 -2432 -4224 -1632 2
RECTANGLE Normal -4608 -1536 -6048 -736 2
RECTANGLE Normal -4256 -1536 -4576 -736 2
RECTANGLE Normal -3744 -1536 -4224 -736 2
RECTANGLE Normal -4608 -640 -6048 160 2
RECTANGLE Normal -4256 -640 -4576 160 2
RECTANGLE Normal -3744 -640 -4224 160 2

The netlist it stands for:
* tl1.asc
R1a N012 N011 11800
R2a N012 N003 3920
R3a N004 N002 3920
R4a N001 N002 1K
R5a N001 0 1K
C1a N004 N003 100nF
C2a N012 0 100nF
V1 N011 N030 SINE(0 0.1 800 20m 0 0 8) AC 1 0
R1b N045 N011 8060
R2b N045 N032 2670
R3b N034 N028 2670
R4b N031 N028 1K
R5b N031 0 1K
C1b N034 N032 100nF
C2b N045 0 100nF
R3c N066 N011 6040
R5c N066 N054 2000
R6c N056 N051 2000
R7c N053 N051 1K
R8c N053 0 1K
C1c N056 N054 100nF
C2c N066 0 100nF
V2 N030 N035 SINE(0 0.1 600 10m 0 0 6)
V3 N035 0 SINE(0 0.1 400 0 0 0 4)
Rr1a N005 N002 1K
Rr2a N006 N005 1K
Rr3a 0 N006 1K
Dr1a N005 N009 D
Dr2a N009 N006 D
Rr7a N007 N006 100K
Vcc 10V 0 10V
Rr4a N014 N002 1K
Rr5a N015 N014 1K
Rr6a 0 N015 1K
Rr9a N016 N015 100K
Dr3a N021 N014 D
Dr4a N015 N021 D
Rr8a N008 N007 270K
Rr12a N022 N017 10K
Rr13a N013 N010 10K
Rr11a N010 N008 10K
Rr14a N022 0 10K
Re1a N020 N013 10K
Ce1a N020 0 100nF
Rd1a 10V N018 10K
Rd2a N018 0 180
Rd3a Vo1 N019 1K
Dd1a Vo1 10V D
Dd2a 0 Vo1 D
XU1b N031 N034 10V -10V N032 TL081  ; pins + - ? ? ?
Vee -10V 0 -10V
XU2a N012 N004 10V -10V N002 TL081  ; pins + - ? ? ?
XU1c N053 N056 10V -10V N054 TL081  ; pins + - ? ? ?
XU1a N001 N004 10V -10V N003 TL081  ; pins + - ? ? ?
XU1 N045 N034 10V -10V N028 TL081  ; pins + - ? ? ?
XU2 N066 N056 10V -10V N051 TL081  ; pins + - ? ? ?
XU5a 0 N007 10V -10V N008 TL081  ; pins + - ? ? ?
XU7a N022 N010 10V -10V N013 TL081  ; pins + - ? ? ?
Rr10a N017 N016 270K
XU6a 0 N016 10V -10V N017 TL081  ; pins + - ? ? ?
XU3a 0 N005 10V -10V N009 TL081  ; pins + - ? ? ?
XU4a 0 N014 10V -10V N021 TL081  ; pins + - ? ? ?
XU8a N020 N018 10V -10V N019 TL081  ; pins + - ? ? ?
Rr1b N023 N028 1K
Rr2b N024 N023 1K
Rr3b 0 N024 1K
Dr1b N023 N027 D
Dr2b N027 N024 D
Rr7b N025 N024 100K
Rr4b N036 N028 1K
Rr5b N037 N036 1K
Rr6b 0 N037 1K
Rr9b N038 N037 100K
Dr3b N043 N036 D
Dr4b N037 N043 D
Rr8b N026 N025 270K
Rr12b N044 N039 10K
Rr13b N033 N029 10K
Rr11b N029 N026 10K
Rr14b N044 0 10K
Re1b N042 N033 10K
Ce1b N042 0 100nF
Rd1b 10V N040 10K
Rd2b N040 0 270
Rd3b Vo2 N041 1K
Dd1b Vo2 10V D
Dd2b 0 Vo2 D
XU5b 0 N025 10V -10V N026 TL081  ; pins + - ? ? ?
XU7b N044 N029 10V -10V N033 TL081  ; pins + - ? ? ?
Rr10b N039 N038 270K
XU6b 0 N038 10V -10V N039 TL081  ; pins + - ? ? ?
XU3b 0 N023 10V -10V N027 TL081  ; pins + - ? ? ?
XU4b 0 N036 10V -10V N043 TL081  ; pins + - ? ? ?
XU8b N042 N040 10V -10V N041 TL081  ; pins + - ? ? ?
Rr1c N046 N051 1K
Rr2c N047 N046 1K
Rr3c 0 N047 1K
Dr1c N046 N050 D
Dr2c N050 N047 D
Rr7c N048 N047 100K
Rr4c N057 N051 1K
Rr5c N058 N057 1K
Rr6c 0 N058 1K
Rr9c N059 N058 100K
Dr3c N064 N057 D
Dr4c N058 N064 D
Rr8c N049 N048 270K
Rr12c N065 N060 10K
Rr13c N055 N052 10K
Rr11c N052 N049 10K
Rr14c N065 0 10K
Re1c N063 N055 10K
Ce1c N063 0 100nF
Rd1c 10V N061 10K
Rd2c N061 0 270
Rd3c Vo3 N062 1K
Dd1c Vo3 10V D
Dd2c 0 Vo3 D
XU5c 0 N048 10V -10V N049 TL081  ; pins + - ? ? ?
XU7c N065 N052 10V -10V N055 TL081  ; pins + - ? ? ?
Rr10c N060 N059 270K
XU6c 0 N059 10V -10V N060 TL081  ; pins + - ? ? ?
XU3c 0 N046 10V -10V N050 TL081  ; pins + - ? ? ?
XU4c 0 N057 10V -10V N064 TL081  ; pins + - ? ? ?
XU8c N063 N061 10V -10V N062 TL081  ; pins + - ? ? ?
.model D D
.lib standard.dio
.tran 0 40m 0 100n
* Recificador de precisión
* Detector de envolvente
* Discriminador
* Recificador de precisión
* Detector de envolvente
* Discriminador
* Recificador de precisión
* Detector de envolvente
* Discriminador
.lib C:\TL081.net
.backanno
.end